# Altium project wireless-charging-prototype.PrjPcb
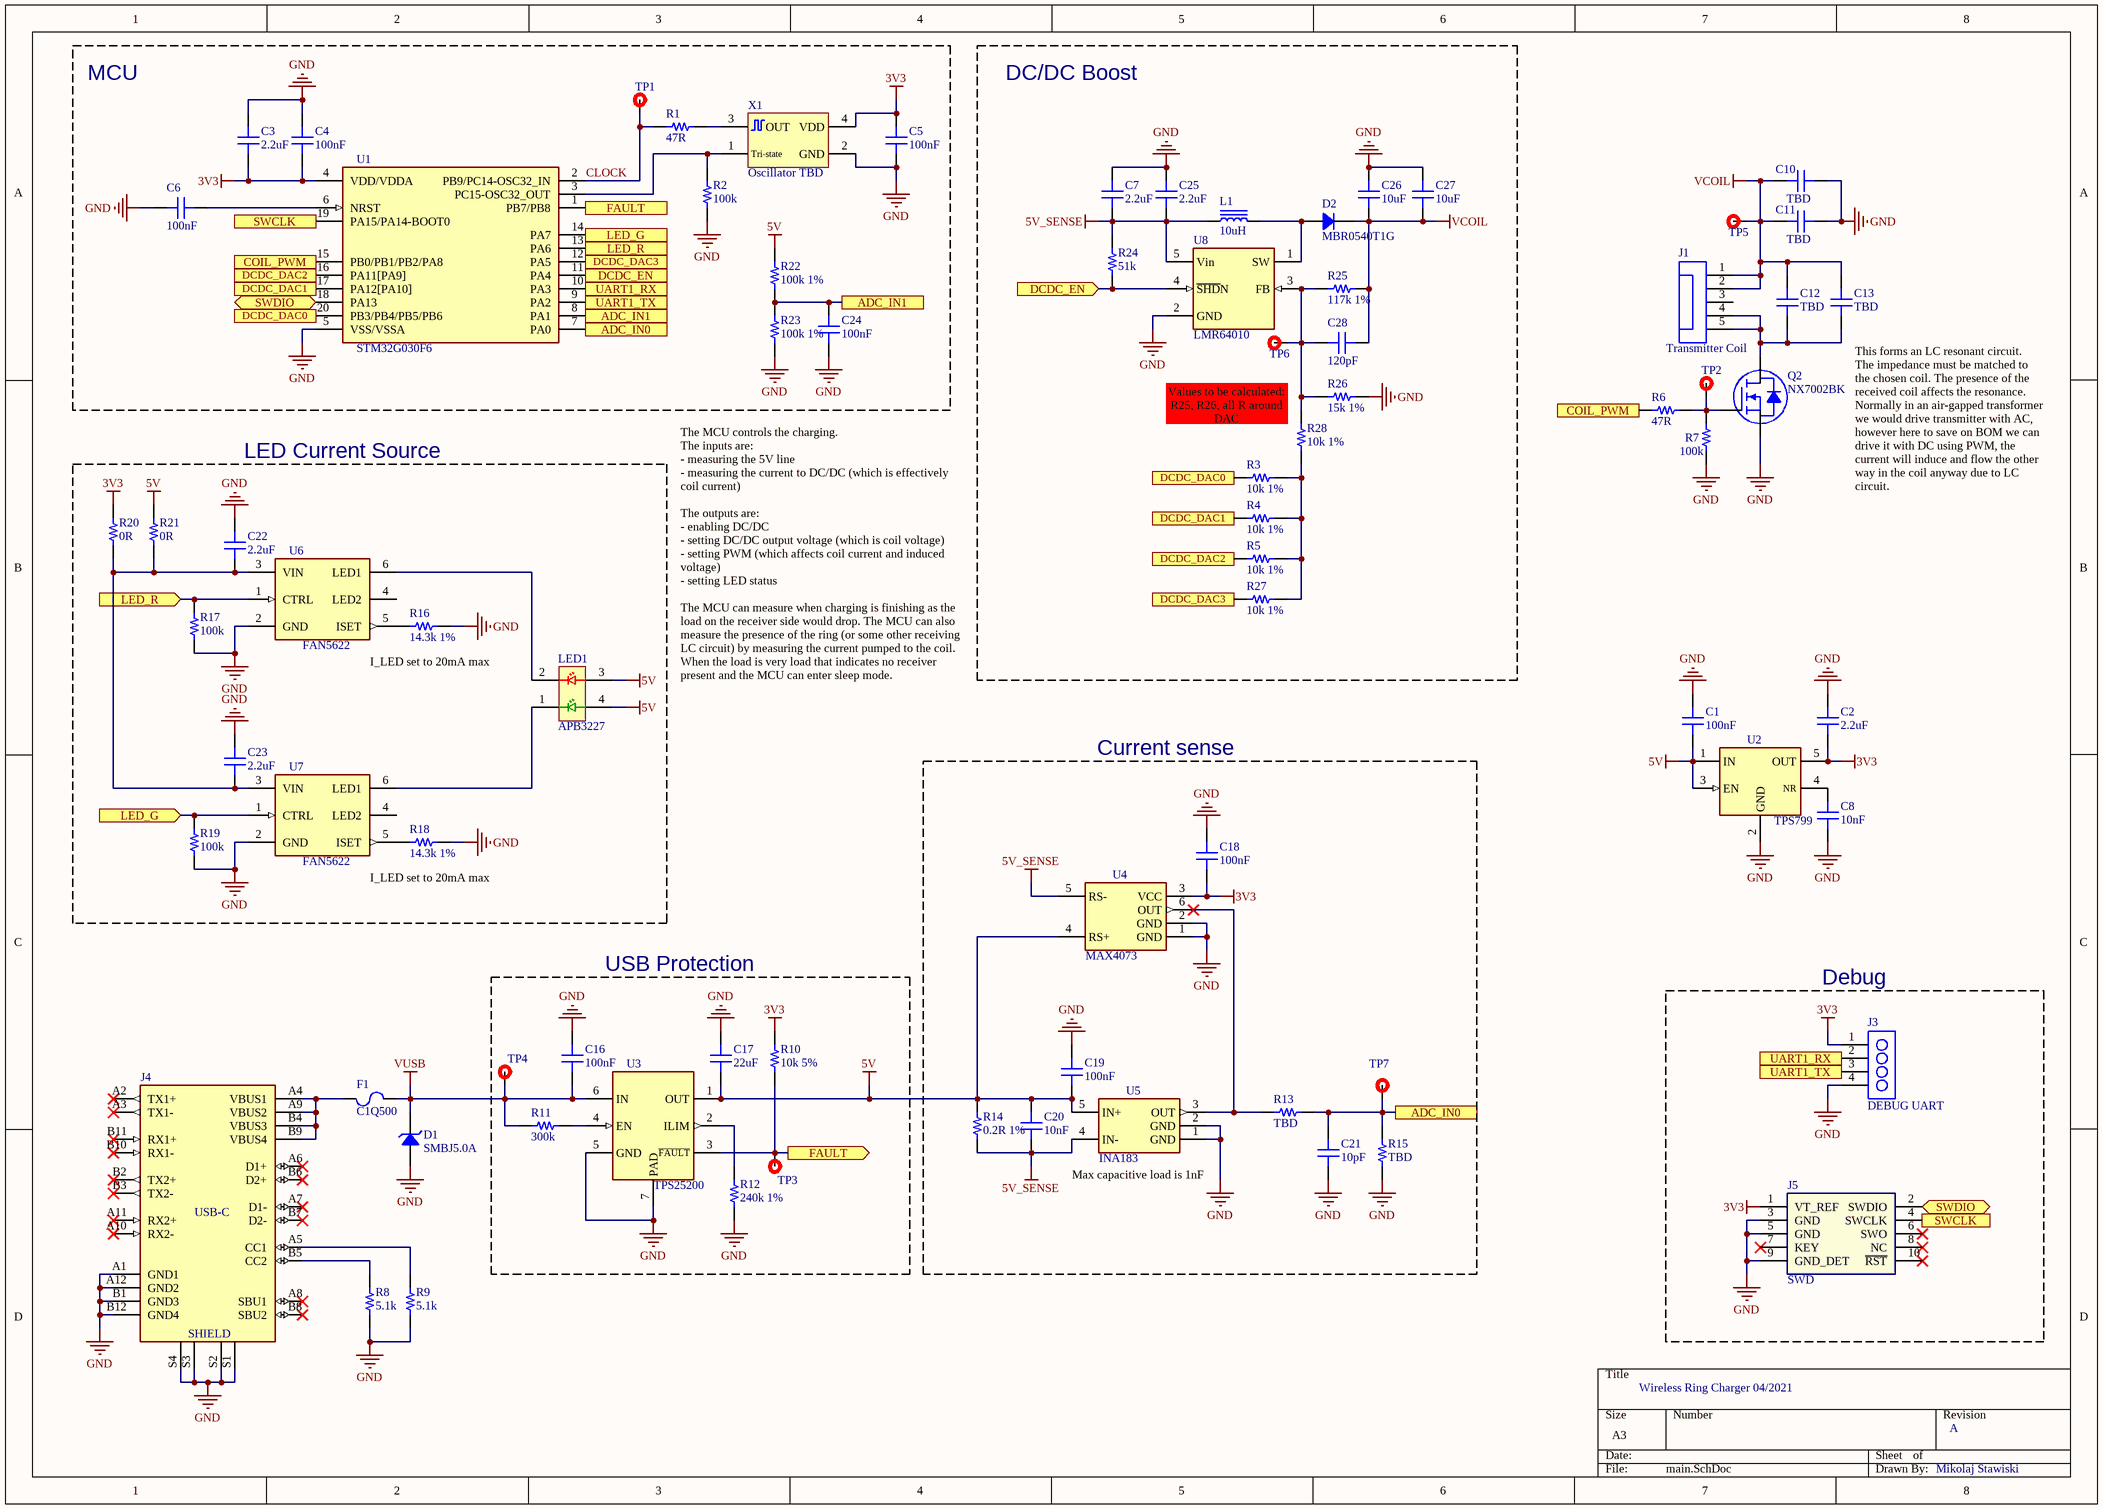
[diagram p0: main.SchDoc]
1 sheet, 79 parts. Net scope: global (net labels, ports and power ports of the same name join across sheets).
Board file: main.PcbDoc

## Sheet main.SchDoc
size A3

### Parts
C1  100nF  [SMD_CAPACITOR_0402]
C2  2.2uF  [SMD_CAPACITOR_0603]
C3  2.2uF  [SMD_CAPACITOR_0603]
C4  100nF  [SMD_CAPACITOR_0402]
C5  100nF  [SMD_CAPACITOR_0402]
C6  100nF  [SMD_CAPACITOR_0402]
C7  2.2uF  [SMD_CAPACITOR_0603]
C8  10nF  [SMD_CAPACITOR_0402]
C10  TBD  [SMD_CAPACITOR_1206]
C11  TBD  [SMD_CAPACITOR_1206]
C12  TBD  [SMD_CAPACITOR_1206]
C13  TBD  [SMD_CAPACITOR_1206]
C16  100nF  [SMD_CAPACITOR_0603]
C17  22uF  [SMD_CAPACITOR_0805]
C18  100nF  [SMD_CAPACITOR_0402]
C19  100nF  [SMD_CAPACITOR_0402]
C20  10nF  [SMD_CAPACITOR_0402]
C21  10pF  [SMD_CAPACITOR_0402]
C22  2.2uF  [SMD_CAPACITOR_0603]
C23  2.2uF  [SMD_CAPACITOR_0603]
C24  100nF  [SMD_CAPACITOR_0402]
C25  2.2uF  [SMD_CAPACITOR_0603]
C26  10uF  [SMD_CAPACITOR_1206]
C27  10uF  [SMD_CAPACITOR_1206]
C28  120pF  [SMD_CAPACITOR_0402]
D1  SMBJ5.0A  [SMD_DIODE_DO-214AA]
D2  MBR0540T1G  [SOD-123]
F1  C1Q500  [SMD_RESISTOR_1206]
J1  Transmitter Coil  [FPC_5PIN_0545500571]
J3  DEBUG UART  [HEADER_4PIN_0022272041]
J4  USB-C  [USBC_105450-0101]
J5  SWD  [CONN_SWD_10PIN]
L1  10uH  [1008_MLP2520]
LED1  APB3227  [1210_LED]
Q2  NX7002BK  [SOT23-3-GSD]
R1  47R  [SMD_RESISTOR_0402]
R2  100k  [SMD_RESISTOR_0402]
R3  10k 1%  [SMD_RESISTOR_0402]
R4  10k 1%  [SMD_RESISTOR_0402]
R5  10k 1%  [SMD_RESISTOR_0402]
R6  47R  [SMD_RESISTOR_0402]
R7  100k  [SMD_RESISTOR_0402]
R8  5.1k  [SMD_RESISTOR_0402]
R9  5.1k  [SMD_RESISTOR_0402]
R10  10k 5%  [SMD_RESISTOR_0402]
R11  300k  [SMD_RESISTOR_0402]
R12  240k 1%  [SMD_RESISTOR_0402]
R13  TBD  [SMD_RESISTOR_0402]
R14  0.2R 1%  [SMD_RESISTOR_1206]
R15  TBD  [SMD_RESISTOR_0402]
R16  14.3k 1%  [SMD_RESISTOR_0402]
R17  100k  [SMD_RESISTOR_0402]
R18  14.3k 1%  [SMD_RESISTOR_0402]
R19  100k  [SMD_RESISTOR_0402]
R20  0R  [SMD_RESISTOR_0603]
R21  0R  [SMD_RESISTOR_0603]
R22  100k 1%  [SMD_RESISTOR_0402]
R23  100k 1%  [SMD_RESISTOR_0402]
R24  51k  [SMD_RESISTOR_0402]
R25  117k 1%  [SMD_RESISTOR_0402]
R26  15k 1%  [SMD_RESISTOR_0402]
R27  10k 1%  [SMD_RESISTOR_0402]
R28  10k 1%  [SMD_RESISTOR_0402]
TP1  Testpoint  [Testpoint 2mm]  (value not drawn)
TP2  Testpoint  [Testpoint 2mm]  (value not drawn)
TP3  Testpoint  [Testpoint 2mm]  (value not drawn)
TP4  Testpoint  [Testpoint 2mm]  (value not drawn)
TP5  Testpoint  [Testpoint 2mm]  (value not drawn)
TP6  Testpoint  [Testpoint 2mm]  (value not drawn)
TP7  Testpoint  [Testpoint 2mm]  (value not drawn)
U1  STM32G030F6  [TSSOP20]
U2  TPS799  [SO23-5]
U3  TPS25200  [WSON6]
U4  MAX4073  [SOT23-6]
U5  INA183  [SO23-5]
U6  FAN5622  [SOT23-6]
U7  FAN5622  [SOT23-6]
U8  LMR64010  [SO23-5]
X1  Oscillator TBD  [ECS-2520MVLC]

### Blocks framed on the sheet
MCU: C3-C6 C24 R1 R2 R22 R23 TP1 U1 X1
DC/DC Boost: C7 C25-C28 D2 L1 R3-R5 R24-R28 TP6 U8
LED Current Source: C22 C23 LED1 R16-R21 U6 U7
Current sense: C18-C21 R13-R15 TP7 U4 U5
USB Protection: C16 C17 R10-R12 TP3 TP4 U3
Debug: J3 J5

### Ports
ADC_IN0, ADC_IN1, COIL_PWM (in), COIL_PWM (out), DCDC_DAC0, DCDC_DAC1, DCDC_DAC2, DCDC_DAC3, DCDC_EN (in), DCDC_EN (out), FAULT (in), FAULT (out), LED_G (in), LED_G (out), LED_R (in), LED_R (out), SWCLK (in), SWCLK (out), SWDIO (bidir), UART1_RX (in), UART1_RX (out), UART1_TX (in), UART1_TX (out)

### Nets
3V3: C2.1 C3.1 C4.1 C5.2 C18.1 J3.1 J5.1(VT_REF) R10.2 R20.2 U1.4(VDD/VDDA) U2.5(OUT) U4.3(VCC) X1.4(VDD)
5V: C1.1 C17.2 C19.1 C20.2 LED1.3 LED1.4 R14.2 R21.2 R22.2 U2.1(IN) U2.3(EN) U3.1(OUT) U4.4(RS+) U5.5(IN+)
5V_SENSE: C7.1 C20.1 C25.1 L1.1 R14.1 R24.1 U4.5(RS-) U5.4(IN-) U8.5(Vin)
GND: C1.2 C2.2 C3.2 C4.2 C5.1 C6.2 C7.2 C8.1 C10.1 C11.1 C16.2 C17.1 C18.2 C19.2 C21.1 C22.2 C23.2 C24.1 C25.2 C26.2 C27.2 D1.1 J3.4 J4.A1(GND1) J4.A12(GND2) J4.B1(GND3) J4.B12(GND4) J4.S1(SHIELD) J4.S2(SHIELD) J4.S3(SHIELD) J4.S4(SHIELD) J5.3(GND) J5.5(GND) J5.9(GND_DET) Q2.S R2.1 R7.1 R8.1 R9.1 R12.1 R15.1 R16.2 R17.1 R18.2 R19.1 R23.1 R26.2 U1.5(VSS/VSSA) U2.2(GND) U3.5(GND) U3.7(PAD) U4.1(GND) U4.2(GND) U5.1(GND) U5.2(GND) U6.2(GND) U7.2(GND) U8.2(GND) X1.2(GND)
VCOIL: C10.2 C11.2 C12.2 C13.2 C26.1 C27.1 C28.1 D2.2 J1.1 J1.2 R25.2 TP5.1
VUSB: C16.1 D1.2 F1.2 R11.2 TP4.1 U3.6(IN)
ADC_IN0: C21.2 R13.1 R15.2 TP7.1 U1.7(PA0) ; port ADC_IN0
ADC_IN1: C24.2 R22.1 R23.2 U1.8(PA1) ; port ADC_IN1
CLOCK: R1.2 TP1.1 U1.2(PB9/PC14-OSC32_IN)
COIL_PWM: R6.1 U1.15(PB0/PB1/PB2/PA8) ; port COIL_PWM
DCDC_DAC0: R3.1 U1.20(PB3/PB4/PB5/PB6) ; port DCDC_DAC0
DCDC_DAC1: R4.1 U1.17(PA12[PA10]) ; port DCDC_DAC1
DCDC_DAC2: R5.1 U1.16(PA11[PA9]) ; port DCDC_DAC2
DCDC_DAC3: R27.1 U1.12(PA5) ; port DCDC_DAC3
DCDC_EN: R24.2 U1.11(PA4) U8.4(~{SHD}N) ; port DCDC_EN
FAULT: R10.1 TP3.1 U1.1(PB7/PB8) U3.3(~{FAULT}) ; port FAULT
LED_G: R19.2 U1.14(PA7) U7.1(CTRL) ; port LED_G
LED_R: R17.2 U1.13(PA6) U6.1(CTRL) ; port LED_R
SWCLK: J5.4(SWCLK) U1.19(PA15/PA14-BOOT0) ; port SWCLK
SWDIO: J5.2(SWDIO) U1.18(PA13) ; port SWDIO
UART1_RX: J3.2 U1.10(PA3) ; port UART1_RX
UART1_TX: J3.3 U1.9(PA2) ; port UART1_TX
NetC6_1: C6.1 U1.6(NRST)
NetC8_2: C8.2 U2.4(NR)
NetC12_1: C12.1 C13.1 J1.4 J1.5 Q2.D
NetC22_1: C22.1 C23.1 R20.1 R21.1 U6.3(VIN) U7.3(VIN)
NetC28_2: C28.2 R25.1 R26.1 R28.2 TP6.1 U8.3(FB)
NetD2_1: D2.1 L1.2 U8.1(SW)
NetF1_1: F1.1 J4.A4(VBUS1) J4.A9(VBUS2) J4.B4(VBUS3) J4.B9(VBUS4)
NetJ4_A5: J4.A5(CC1) R9.2
NetJ4_B5: J4.B5(CC2) R8.2
NetLED1_1: LED1.1 U7.6(LED1)
NetLED1_2: LED1.2 U6.6(LED1)
NetQ2_G: Q2.G R6.2 R7.2 TP2.1
NetR1_1: R1.1 X1.3(OUT)
NetR2_2: R2.2 U1.3(PC15-OSC32_OUT) X1.1(Tri-state)
NetR3_2: R3.2 R4.2 R5.2 R27.2 R28.1
NetR11_1: R11.1 U3.4(EN)
NetR12_2: R12.2 U3.2(ILIM)
NetR13_2: R13.2 U4.6(OUT) U5.3(OUT)
NetR16_1: R16.1 U6.5(ISET)
NetR18_1: R18.1 U7.5(ISET)

Not connected (* = marked no-connect by the designer): J1 3; J4 A2(TX1+)* A3(TX1-)* A6(D1+)* A7(D1-)* A8(SBU1)* A10(RX2-)* A11(RX2+)* B2(TX2+)* B3(TX2-)* B6(D2+)* B7(D2-)* B8(SBU2)* B10(RX1-)* B11(RX1+)*; J5 6(SWO)* 7(KEY)* 8(NC)* 10(~{RST})*; U6 4(LED2); U7 4(LED2)

### Notes on the sheet
- (near R28) Values to be calculated: R25, R26, all R around DAC
- (near C13) This forms an LC resonant circuit. The impedance must be matched to the chosen coil. The presence of the received coil affects the resonance. Normally in an air-gapped transformer we would drive transmitter with AC, however here to save on BOM we can drive it with DC using PWM, the current will induce and flow the other way in the coil anyway due to LC circuit.
- I_LED set to 20mA max
- The MCU controls the charging.
  The inputs are:
  - measuring the 5V line
  - measuring the current to DC/DC (which is effectively coil current)
  The outputs are:
  - enabling DC/DC
  - setting DC/DC output voltage (which is coil voltage)
  - setting PWM (which affects coil current and induced voltage)
  - setting LED status
  The MCU can measure when charging is finishing as the load on the receiver side would drop. The MCU can also measure the presence of the ring (or some other receiving LC circuit) by measuring the current pumped to the coil. When the load is very load that indicates no receiver present and the MCU can enter sleep mode.
- (near U5) Max capacitive load is 1nF
- Wireless Ring Charger 04/2021
- A
- Mikolaj Stawiski

### Library data of the parts
C1 C4-C6 C18 C19 C24 = CAPACITOR_0402: Capacitor SMT 0402; Part Number: GRM155R71H104KE14D; Manufacturer: Murata; Tolerance: 10%; Voltage - Rated: 10V; Value: 100nF; Device Package: 0402 (1005 Metric); Mounting Type: SMT; Operating Temperature: *; Size / Dimension: 0.039" L x 0.020" W (1.00mm x 0.50mm); Thickness (Max): *; Distributor link 1: https://www.digikey.com/en/products/detail/murata-electronics/GRM155R71H104KE14D/4906220; Distributor link 2: *; Distributor link 3: *
C2 C3 C7 C22 C23 C25 = CAPACITOR_0603: Capacitor SMT 0603; Part Number: CL10A225KP8NNNC; Manufacturer: Samsung; Tolerance: 10%; Voltage - Rated: 10V; Value: 2.2uF; Device Package: 0603 (1608 Metric); Mounting Type: SMT; Operating Temperature: *; Size / Dimension: 0.063" L x 0.031" W (1.60mm x 0.80mm); Thickness (Max): *; Distributor link 1: https://www.digikey.com/en/products/detail/samsung-electro-mechanics/CL10A225KP8NNNC/3886743; Distributor link 2: *; Distributor link 3: *
C8 C20 = CAPACITOR_0402: Capacitor SMT 0402; Manufacturer: Murata; Tolerance: 10%; Voltage - Rated: 10V; Part Number: *; Value: 10nF; Device Package: 0402 (1005 Metric); Mounting Type: SMT; Operating Temperature: *; Size / Dimension: 0.039" L x 0.020" W (1.00mm x 0.50mm); Thickness (Max): *; Distributor link 2: *; Distributor link 3: *
  C8: Distributor link 1: https://www.digikey.com/en/products/detail/murata-electronics/GRM155R71H104KE14D/4906220
  C20: Distributor link 1: *
C10-C13 = CAPACITOR_1206: Capacitor SMT 1206; Part Number: *; Value: TBD; Device Package: 1206 (3216 Metric); Manufacturer: *; Mounting Type: SMT; Operating Temperature: *; Size / Dimension: 0.126" L x 0.063" W (3.20mm x 1.60mm); Thickness (Max): *; Tolerance: *; Voltage - Rated: *; Distributor link 1: *; Distributor link 2: *; Distributor link 3: *
C16 = CAPACITOR_0603: Capacitor SMT 0603; Tolerance: 10%; Voltage - Rated: 50V; Part Number: *; Value: 100nF; Device Package: 0603 (1608 Metric); Manufacturer: *; Mounting Type: SMT; Operating Temperature: *; Size / Dimension: 0.063" L x 0.031" W (1.60mm x 0.80mm); Thickness (Max): *; Distributor link 1: *; Distributor link 2: *; Distributor link 3: *
C17 = CAPACITOR_0805: Capacitor SMT 0805; Part Number: CL21A226MOCLRNC; Manufacturer: Samsung; Tolerance: 20%; Voltage - Rated: 16V; Value: 22uF; Device Package: 0805 (2012 Metric); Mounting Type: SMT; Operating Temperature: *; Size / Dimension: 0.079" L x 0.049" W (2.00mm x 1.25mm); Thickness (Max): 0.95mm; Distributor link 1: https://www.digikey.com/en/products/detail/samsung-electro-mechanics/CL21A226MOCLRNC/5961264; Distributor link 2: *; Distributor link 3: *
C21 = CAPACITOR_0402: Capacitor SMT 0402; Tolerance: 10%; Voltage - Rated: 10V; Part Number: *; Value: 10pF; Device Package: 0402 (1005 Metric); Manufacturer: *; Mounting Type: SMT; Operating Temperature: *; Size / Dimension: 0.039" L x 0.020" W (1.00mm x 0.50mm); Thickness (Max): *; Distributor link 1: *; Distributor link 2: *; Distributor link 3: *
C26 C27 = CAPACITOR_1206: Capacitor SMT 1206; Part Number: C3216X5R1H106K160AB; Manufacturer: TDK; Tolerance: 10%; Voltage - Rated: 50V; Value: 10uF; Device Package: 1206 (3216 Metric); Mounting Type: SMT; Operating Temperature: *; Size / Dimension: 0.126" L x 0.063" W (3.20mm x 1.60mm); Thickness (Max): *; Distributor link 1: https://www.digikey.com/en/products/detail/tdk-corporation/C3216X5R1H106K160AB/2443476; Distributor link 2: *; Distributor link 3: *
C28 = CAPACITOR_0402: Capacitor SMT 0402; Manufacturer: Murata; Tolerance: 10%; Voltage - Rated: 50V; Part Number: *; Value: 120pF; Device Package: 0402 (1005 Metric); Mounting Type: SMT; Operating Temperature: *; Size / Dimension: 0.039" L x 0.020" W (1.00mm x 0.50mm); Thickness (Max): *; Distributor link 1: *; Distributor link 2: *; Distributor link 3: *
D1 = DIODE_TVS_GENERIC: Generic TVS Diode; Manufacturer: Bourns; Part Number: SMBJ5.0A; Value: SMBJ5.0A; Device Package: DO-214AA; Mounting Type: SMT; Operating Temperature: *; Size / Dimension: *; Thickness (Max): *; Tolerance: *; Voltage - Rated: *; Distributor link 1: https://www.digikey.com/en/products/detail/bourns-inc/SMBJ5-0A/2254202; Distributor link 2: *; Distributor link 3: *
D2 = DIODE_GENERIC: Diode Generic; Part Number: MBR0540T1G; Value: MBR0540T1G; Device Package: SOD-123; Manufacturer: *; Mounting Type: SMT; Operating Temperature: *; Size / Dimension: *; Thickness (Max): *; Tolerance: *; Voltage - Rated: *; Distributor link 1: https://www.digikey.com/en/products/detail/on-semiconductor/MBR0540T1G/917967; Distributor link 2: *; Distributor link 3: *
F1 = FUSE_GENERIC: Generic Fuse; Manufacturer: Bel Fuse Inc.; Voltage - Rated: 63 VDC; Part Number: C1Q500; Value: C1Q500; Device Package: 1206 (3216 Metric); Mounting Type: SMT; Operating Temperature: *; Size / Dimension: 3.20mm x 1.58mm x 0.58mm; Thickness (Max): *; Tolerance: *; Distributor link 1: https://www.digikey.com/en/products/detail/bel-fuse-inc/C1Q-500/615155; Distributor link 2: *; Distributor link 3: *
J1 = CONN_FPC_5PIN: FPC connector 5-pin generic; Part Number: *; Value: Transmitter Coil; Device Package: *; Manufacturer: *; Mounting Type: *; Operating Temperature: *; Size / Dimension: *; Thickness (Max): *; Voltage - Rated: *; Distributor link 1: *; Distributor link 2: *; Distributor link 3: *
J3 = CONN_4PIN: Connector 4-pin generic; Part Number: *; Value: *; Device Package: *; Manufacturer: *; Mounting Type: *; Operating Temperature: *; Size / Dimension: *; Thickness (Max): *; Voltage - Rated: *; Distributor link 1: *; Distributor link 2: *; Distributor link 3: *
J4 = CONN_USBC: USB-C connector; Part Number: 1054500101; Manufacturer: Molex; Value: USB-C; Device Package: *; Mounting Type: SMT; Operating Temperature: *; Size / Dimension: *; Thickness (Max): *; Voltage - Rated: *; Distributor link 1: https://www.digikey.com/en/products/detail/molex/1054500101/5843890; Distributor link 2: *; Distributor link 3: *
J5 = CONN_10PIN_SWD_ARM: 10-pin ARM SWD connector for debugging; Part Number: FTSH-105-01-L-DV-K; Manufacturer: Samtec; Value: SWD; Device Package: *; Mounting Type: *; Operating Temperature: *; Package / Case: *; Size / Dimension: *; Distributor link 1: *; Distributor link 2: *; Distributor link 3: *
L1 = INDUCTOR_GENERIC: Inductor Generic; Part Number: MLP2520S100ST0S1; Manufacturer: TDK; Tolerance: 20%; Value: 10uH; Device Package: 1008 (2520 Metric); Mounting Type: SMT; Operating Temperature: *; Size / Dimension: 0.098" L x 0.079" W (2.50mm x 2.00mm); Thickness (Max): 1.2mm; Voltage - Rated: *; Distributor link 1: https://www.digikey.com/en/products/detail/MLP2520S100ST0S1/445-9507-1-ND/3909680?itemSeq=362222387; Distributor link 2: *; Distributor link 3: *
LED1 = APB3227: APB3227 3.2 x 2.7 mm Surface Mount LED Lamp; Manufacturer: Kingbright; Part Number: APB3227; Value: APB3227; Device Package: 4-SMD; Mounting Type: SMT; Operating Temperature: *; Package / Case: *; Size / Dimension: *; Thickness (Max): *; Distributor link 1: *; Distributor link 2: *; Distributor link 3: *; Link: https://www.kingbrightusa.com/kcpartno.asp?txtPartNo=APB3227
Q2 = MOSFET_N_GDS: N-MOSFET SMT; Part Number: NX7002BK; Value: NX7002BK; Device Package: *; Manufacturer: *; Mounting Type: SMT; Operating Temperature: *; Size / Dimension: *; Thickness (Max): *; Voltage - Rated: *; Distributor link 1: *; Distributor link 2: *; Distributor link 3: *
R1 R2 R6-R9 R11 R13 R15 R17 R19 R24 = RESISTOR_0402: Resistor SMT 0402; Tolerance: 5%; Part Number: *; Device Package: 0402 (1005 Metric); Manufacturer: *; Mounting Type: SMT; Operating Temperature: *; Size / Dimension: 0.039" L x 0.020" W (1.00mm x 0.50mm); Thickness (Max): *; Voltage - Rated: *; Distributor link 1: *; Distributor link 2: *; Distributor link 3: *
  R1 R6: Value: 47R
  R2 R7 R17 R19: Value: 100k
  R8 R9: Value: 5.1k
  R11: Value: 300k
  R13 R15: Value: TBD
  R24: Value: 51k
R3-R5 R10 R12 R16 R18 R22 R23 R25-R28 = RESISTOR_0402: Resistor SMT 0402; Part Number: *; Device Package: 0402 (1005 Metric); Manufacturer: *; Mounting Type: SMT; Operating Temperature: *; Size / Dimension: 0.039" L x 0.020" W (1.00mm x 0.50mm); Thickness (Max): *; Voltage - Rated: *; Distributor link 1: *; Distributor link 2: *; Distributor link 3: *
  R3-R5 R27 R28: Value: 10k 1%; Tolerance: 1%
  R10: Value: 10k 5%; Tolerance: 5%
  R12: Value: 240k 1%; Tolerance: 1%
  R16 R18: Value: 14.3k 1%; Tolerance: 1%
  R22 R23: Value: 100k 1%; Tolerance: 1%
  R25: Value: 117k 1%; Tolerance: 1%
  R26: Value: 15k 1%; Tolerance: 1%
R14 = RESISTOR_1206: Resistor SMT 1206; Part Number: *; Value: 0.2R 1%; Device Package: 1206 (3216 Metric); Manufacturer: *; Mounting Type: SMT; Operating Temperature: *; Size / Dimension: 0.126" L x 0.063" W (3.20mm x 1.60mm); Thickness (Max): *; Tolerance: *; Voltage - Rated: *; Distributor link 1: *; Distributor link 2: *; Distributor link 3: *
R20 R21 = RESISTOR_0603: Resistor SMT 0603; Part Number: *; Value: 0R; Device Package: 0603 (1608 Metric); Manufacturer: *; Mounting Type: SMT; Operating Temperature: *; Size / Dimension: 0.063" L x 0.031" W (1.60mm x 0.80mm); Thickness (Max): *; Tolerance: *; Voltage - Rated: *; Distributor link 1: *; Distributor link 2: *; Distributor link 3: *
TP1-TP7 = Testpoint: Testpoint for measuring at the PCB
U1 = STM32G030F6: Mainstream Value-Line Arm Cortex-M0+ MCU with 32 Kbytes of of Flash memory memory, 8 Kbytes RAM, 64 MHz CPU, 2x USART, timers, ADC, comm. I/F, 2-3.6V; Manufacturer: STM; Part Number: STM32G030F6; Value: STM32G030F6; Device Package: *; Mounting Type: SMT; Operating Temperature: *; Package / Case: *; Size / Dimension: *; Thickness (Max): *; Distributor link 1: https://www.digikey.com/en/products/detail/stmicroelectronics/STM32G030F6P6/10326686; Distributor link 2: *; Distributor link 3: *; Link: https://www.st.com/content/st_com/en/products/microcontrollers-microprocessors/stm32-32-bit-arm-cortex-mcus/stm32-mainstream-mcus/stm32g0-series/stm32g0x0-value-line/stm32g030f6.html
U2 = TPS799XX: TPS799 200-mA, Low-Quiescent Current, Ultralow Noise, High-PSRR Low-Dropout Linear / Regulator; Part Number: TPS79933DDCR‎; Manufacturer: TI; Value: TPS799; Device Package: *; Mounting Type: SMT; Operating Temperature: *; Package / Case: *; Size / Dimension: *; Thickness (Max): *; Distributor link 1: *; Distributor link 2: *; Distributor link 3: *; Link: https://www.ti.com/product/TPS799
U3 = TPS25200: TPS25200 5-V eFuse With Precision Adjustable Current Limit and Overvoltage Clamp; Manufacturer: TI; Part Number: TPS25200; Value: TPS25200; Device Package: WSON6; Mounting Type: SMT; Operating Temperature: *; Package / Case: *; Size / Dimension: *; Thickness (Max): *; Distributor link 1: https://www.digikey.com/en/products/detail/texas-instruments/TPS25200DRVT/4840667; Distributor link 2: *; Distributor link 3: *; Link: https://www.ti.com/product/TPS25200
U4 = MAX4073: Low-Cost, SC70, Voltage-Output, High-Side Current-Sense Amplifier (in SC70 or SOT23); Manufacturer: Maxim Integrated; Part Number: MAX4073; Value: MAX4073; Device Package: SOT23-6 / SC70-5; Mounting Type: SMT; Operating Temperature: *; Package / Case: *; Size / Dimension: *; Thickness (Max): *; Distributor link 1: *; Distributor link 2: *; Distributor link 3: *; Link: https://www.maximintegrated.com/en/products/analog/amplifiers/MAX4073T.html
U5 = INA183: INA183 2.7-V to 26-V, High-Precision Current Sense Amplifier; Manufacturer: TI; Part Number: INA183; Value: INA183; Device Package: SOT23-5; Mounting Type: SMT; Operating Temperature: *; Package / Case: *; Size / Dimension: *; Thickness (Max): *; Distributor link 1: https://www.digikey.com.au/product-detail/en/texas-instruments/INA183A1IDBVR/296-INA183A1IDBVRTR-ND/13896392; Distributor link 2: *; Distributor link 3: *; Link: https://www.ti.com/product/INA183
U6 U7 = FAN5622: Linear LED Drivers with Single-Wire Digital Interface; Manufacturer: Failchild; Part Number: FAN5622; Value: FAN5622; Device Package: SOT23-6; Mounting Type: SMT; Operating Temperature: *; Package / Case: SOT23-6; Size / Dimension: *; Thickness (Max): 1.10; Distributor link 1: https://www.digikey.com/en/products/detail/on-semiconductor/FAN5622SX/2509485; Distributor link 2: *; Distributor link 3: *; Link: https://www.onsemi.com/products/power-management/led-drivers/linear-led-drivers/fan5622sx
U8 = LMR64010: LMR64010 SIMPLE SWITCHER 40Vout, 1A Step-Up Voltage Regulator in SOT-23; Part Number: LMR64010XMF; Manufacturer: TI; Value: LMR64010; Device Package: SOT23-5; Mounting Type: SMT; Operating Temperature: *; Package / Case: *; Size / Dimension: *; Thickness (Max): *; Distributor link 1: https://www.digikey.com/en/products/detail/LMR64010XMFX%2fNOPB/296-38771-1-ND/5125873; Distributor link 2: *; Distributor link 3: *; Link: https://www.ti.com/product/LMR64010
X1 = OSCILLATOR_4PIN_GENERIC: Oscillator 4-pin Generic with tri-state control; Part Number: *; Value: Oscillator TBD; Device Package: *; Manufacturer: *; Mounting Type: *; Operating Temperature: *; Size / Dimension: *; Thickness (Max): *; Voltage - Rated: *; Distributor link 1: *; Distributor link 2: *; Distributor link 3: *